# EAGLE design coreV.01 (EAGLE 7.2.0)
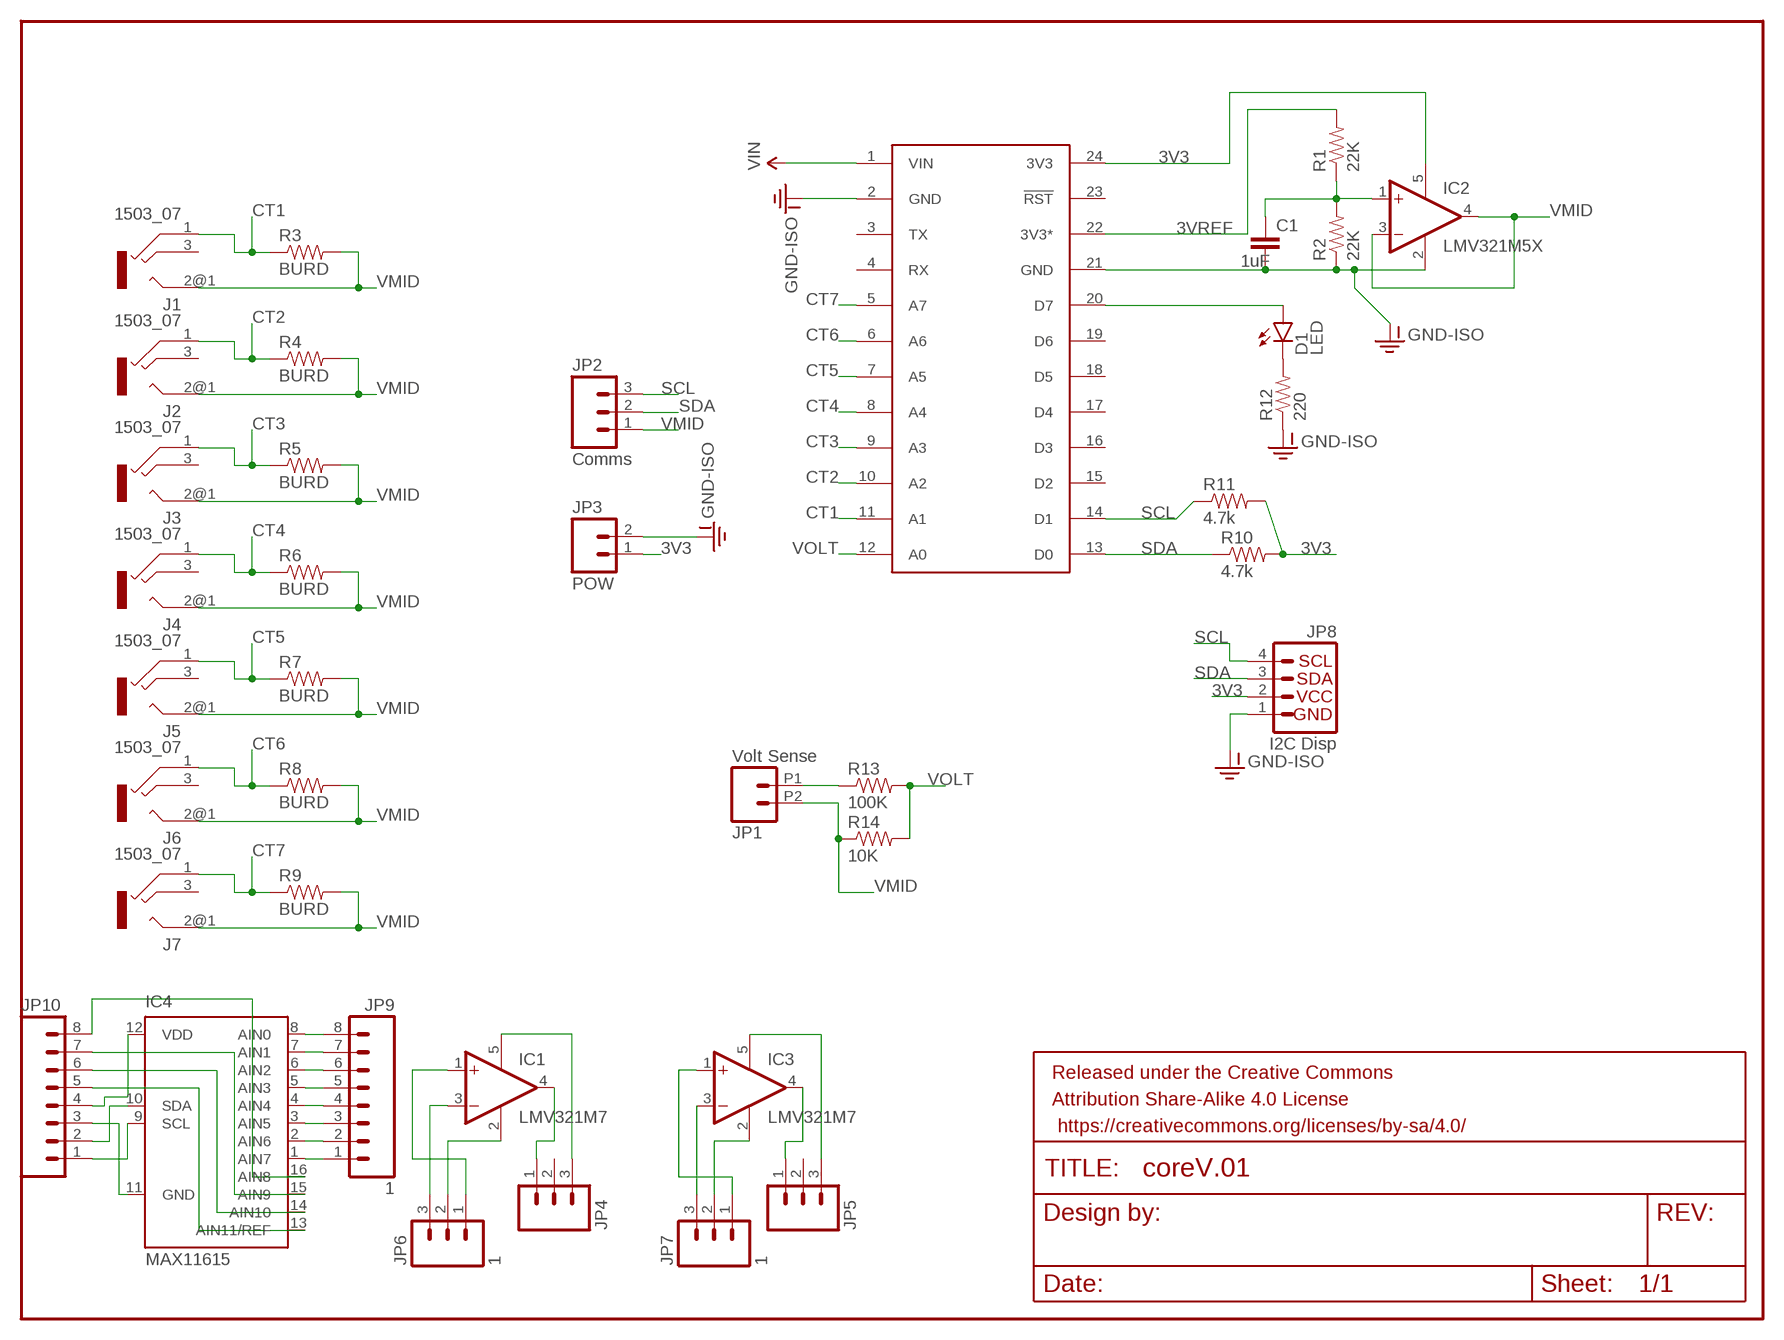
[diagram p0: schematic, sheet 1]

## Parts
C1  1uF  CAPPTH  [CAP-PTH-SMALL]
D1  LED  LED3MM  [LED3MM]
FRAME1  emonCore  FRAME-LETTER  [CREATIVE_COMMONS]
IC1  LMV321M7  [SC70-5L]
IC2  LMV321M5X  [SOT23-5]
IC3  LMV321M7  [SC70-5L]
IC4  MAX11615  MAX1039  [QSOP16]
J1  1503_07  [1503_07]
J2  1503_07  [1503_07]
J3  1503_07  [1503_07]
J4  1503_07  [1503_07]
J5  1503_07  [1503_07]
J6  1503_07  [1503_07]
J7  1503_07  [1503_07]
JP1  Volt Sense  M022.54MM_SCREWTERM  [1X02_2.54_SCREWTERM]
JP2  Comms  M03PTH  [1X03]
JP3  POW  M02PTH  [1X02]
JP4  M03PTH  [1X03]
JP5  M03PTH  [1X03]
JP6  1  M03PTH  [1X03]
JP7  1  M03PTH  [1X03]
JP8  I2C Disp  I2C_STANDARD  [1X04]
JP9  1  M08SILK_FEMALE_PTH  [1X08]
JP10  M08SILK_FEMALE_PTH  [1X08]
R1  22K  RESISTORAXIAL-0.3  [AXIAL-0.3]
R2  22K  RESISTORAXIAL-0.3  [AXIAL-0.3]
R3  BURD  RESISTORAXIAL-0.3  [AXIAL-0.3]
R4  BURD  RESISTORAXIAL-0.3  [AXIAL-0.3]
R5  BURD  RESISTORAXIAL-0.3  [AXIAL-0.3]
R6  BURD  RESISTORAXIAL-0.3  [AXIAL-0.3]
R7  BURD  RESISTORAXIAL-0.3  [AXIAL-0.3]
R8  BURD  RESISTORAXIAL-0.3  [AXIAL-0.3]
R9  BURD  RESISTORAXIAL-0.3  [AXIAL-0.3]
R10  4.7k  RESISTORAXIAL-0.3  [AXIAL-0.3]
R11  4.7k  RESISTORAXIAL-0.3  [AXIAL-0.3]
R12  220  RESISTORAXIAL-0.3  [AXIAL-0.3]
R13  100K  RESISTORAXIAL-0.3  [AXIAL-0.3]
R14  10K  RESISTORAXIAL-0.3  [AXIAL-0.3]
U$1  SPARK_CORE  SPARK_CORECORE  [SPARK_CORE]

## Nets
3V3: IC2.5(V+) JP3.1 JP8.2 R10.P$2 R11.P$2 U$1.24(3V3)
3VREF: R1.P$2 U$1.22(3V3*)
CT1: J1.1 R3.P$1 U$1.11(A1)
CT2: J2.1 R4.P$1 U$1.10(A2)
CT3: J3.1 R5.P$1 U$1.9(A3)
CT4: J4.1 R6.P$1 U$1.8(A4)
CT5: J5.1 R7.P$1 U$1.7(A5)
CT6: J6.1 R8.P$1 U$1.6(A6)
CT7: J7.1 R9.P$1 U$1.5(A7)
GND-ISO: C1.2 IC2.2(V-) JP3.2 JP8.1 R2.P$1 R12.P$1 U$1.2(GND) U$1.21(GND)
N$1: D1.K(C) R12.P$2
N$2: C1.1 IC2.1(+IN) R1.P$1 R2.P$2
N$3: JP1.P1 R13.P$1
N$4: D1.A U$1.20(D7)
N$5: IC3.2(V-) JP7.2
N$6: IC3.1(+IN) JP7.1
N$7: IC3.3(-IN) JP7.3
N$8: IC3.4(OUT) JP5.1
N$9: IC1.2(V-) JP6.2
N$10: IC3.5(V+) JP5.3
N$11: IC1.3(-IN) JP6.3
N$12: IC1.1(+IN) JP6.1
N$13: IC1.4(OUT) JP4.1
N$14: IC1.5(V+) JP4.3
N$15: IC4.1(AIN7) JP9.1
N$16: IC4.2(AIN6) JP9.2
N$17: IC4.3(AIN5) JP9.3
N$18: IC4.4(AIN4) JP9.4
N$19: IC4.5(AIN3) JP9.5
N$20: IC4.6(AIN2) JP9.6
N$21: IC4.7(AIN1) JP9.7
N$22: IC4.8(AIN0) JP9.8
N$23: IC4.9(SCL) JP10.1
N$24: IC4.10(SDA) JP10.2
N$25: IC4.11(GND) JP10.3
N$27: IC4.12(VDD) JP10.4
N$28: IC4.13(AIN11/REF) JP10.5
N$29: IC4.14(AIN10) JP10.6
N$30: IC4.15(AIN9) JP10.7
N$31: IC4.16(AIN8) JP10.8
SCL: JP2.3 JP8.4 R11.P$1 U$1.14(D1)
SDA: JP2.2 JP8.3 R10.P$1 U$1.13(D0)
VIN: U$1.1(VIN)
VMID: IC2.3(-IN) IC2.4(OUT) J1.2@1 J2.2@1 J3.2@1 J4.2@1 J5.2@1 J6.2@1 J7.2@1 JP1.P2 JP2.1 R3.P$2 R4.P$2 R5.P$2 R6.P$2 R7.P$2 R8.P$2 R9.P$2 R14.P$1
VOLT: R13.P$2 R14.P$2 U$1.12(A0)
Unconnected: J1.2@2 J1.3 J2.2@2 J2.3 J3.2@2 J3.3 J4.2@2 J4.3 J5.2@2 J5.3 J6.2@2 J6.3 J7.2@2 J7.3 JP4.2 JP5.2 U$1.3(TX) U$1.4(RX) U$1.15(D2) U$1.16(D3) U$1.17(D4) U$1.18(D5) U$1.19(D6) U$1.23(!RST)

## Library data of the parts
C1 = SparkFun-Capacitors:CAP: Capacitor Standard 0603 ceramic capacitor, and 0.1" leaded capacitor.
D1 = SparkFun-LED:LED: LEDs Standard schematic elements and footprints for 5mm, 3mm, 1206, and 0603 sized LEDs. 5mm - Spark Fun Electronics SKU : COM-00529 (and others)
FRAME1 = SparkFun-Aesthetics:FRAME-LETTER: Schematic Frame Standard 8.5x11 US Letter frame; DESIGNER: NAME; VERSION: v01
IC1-IC3 = linear:LMV321?*: General Purpose, Low Voltage, Rail-to-Rail Output Operational Amplifiers Source: http://www.national.com/mpf/LM/LMV321.html http://www.national.com/dt/lmv_qual.pdf
IC4 = maxim:MAX10*: 2.7V to 5.5V, Low-Power, 4-/12-Channel 2-Wire Serial 8-Bit ADCs Source: http://datasheets.maxim-ic.com/en/ds/MAX1036-MAX1039M.pdf; MF: MAXIM; MPN: MAX1039AEEE+; OC_FARNELL: 1379845; OC_NEWARK: 23K5590
J1-J7 = con-lumberg:1503_?: Jack connectors according to JISC 6560, 3.5 mm Klinkensteckverbinder nach JISC 6560, 3,5 mm Source: http://www.lumberg.com/Produkte/PDFs/1503_08.pdf; OC_FARNELL: unknown; OC_NEWARK: unknown
JP1 JP3 = SparkFun-Connectors:M02: Standard 2-pin 0.1" header. Use with - straight break away headers ( PRT-00116) - right angle break away headers (PRT-00553) - swiss pins (PRT-00743) - machine pins (PRT-00117) - female headers (PRT-00115) Molex polarized connector foot print use with: PRT-08233 with associated crimp pins and housings. 2.54_SCREWTERM for use with PRT-10571. 3.5mm Screw Terminal footprints for PRT-08084 5mm Screw Terminal footprints for use with PRT-08432
JP2 JP4-JP7 = SparkFun-Connectors:M03: Header 3 Standard 3-pin 0.1" header. Use with straight break away headers (SKU : PRT-00116), right angle break away headers (PRT-00553), swiss pins (PRT-00743), machine pins (PRT-00117), and female headers (PRT-00115). Molex polarized connector foot print use with SKU : PRT-08232 with associated crimp pins and housings.
JP8 = SparkFun-Connectors:I2C_STANDARD: SparkFun has standardized on a pinout for all I2C based sensor breakouts. This pinout allows I2C boards to be plugged directly into the headers on Arduino Uno compatible boards, and to be daisy chained easily.
JP9 JP10 = SparkFun-Connectors:M08: Header 8 Standard 8-pin 0.1" header. Use with straight break away headers (SKU : PRT-00116), right angle break away headers (PRT-00553), swiss pins (PRT-00743), machine pins (PRT-00117), and female headers (PRT-00115).; PROD_ID: CONN-08438
R1-R14 = SparkFun-Passives:RESISTOR: Resistor Basic schematic elements and footprints for 0603, 1206, and PTH resistors.
U$1 = Spark:SPARK_CORE

## Net classes
0 default: clearance 0.205 mm

## Board
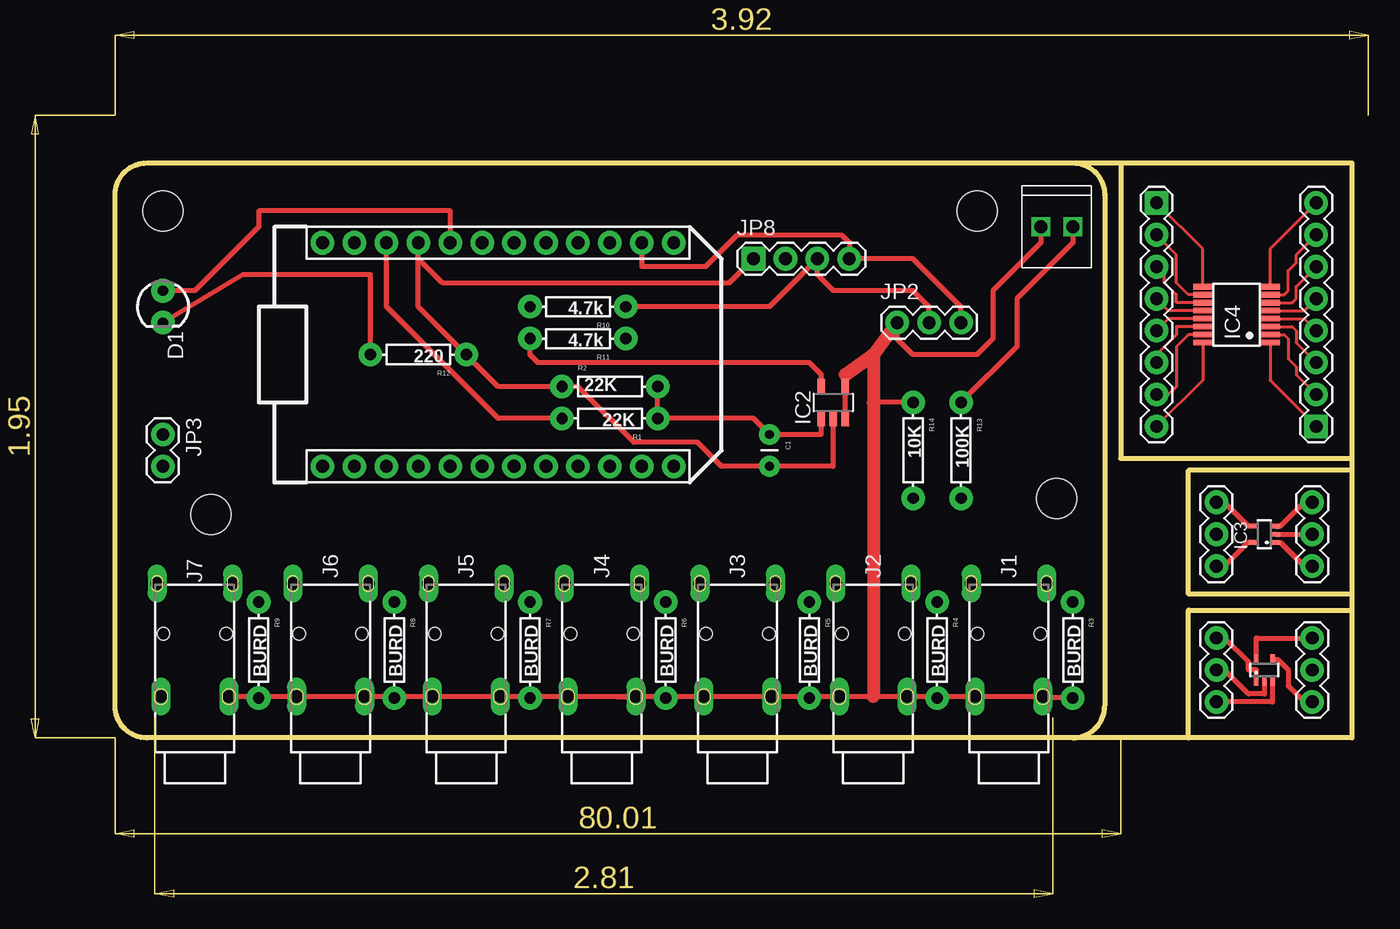
[diagram p1: board, top side]
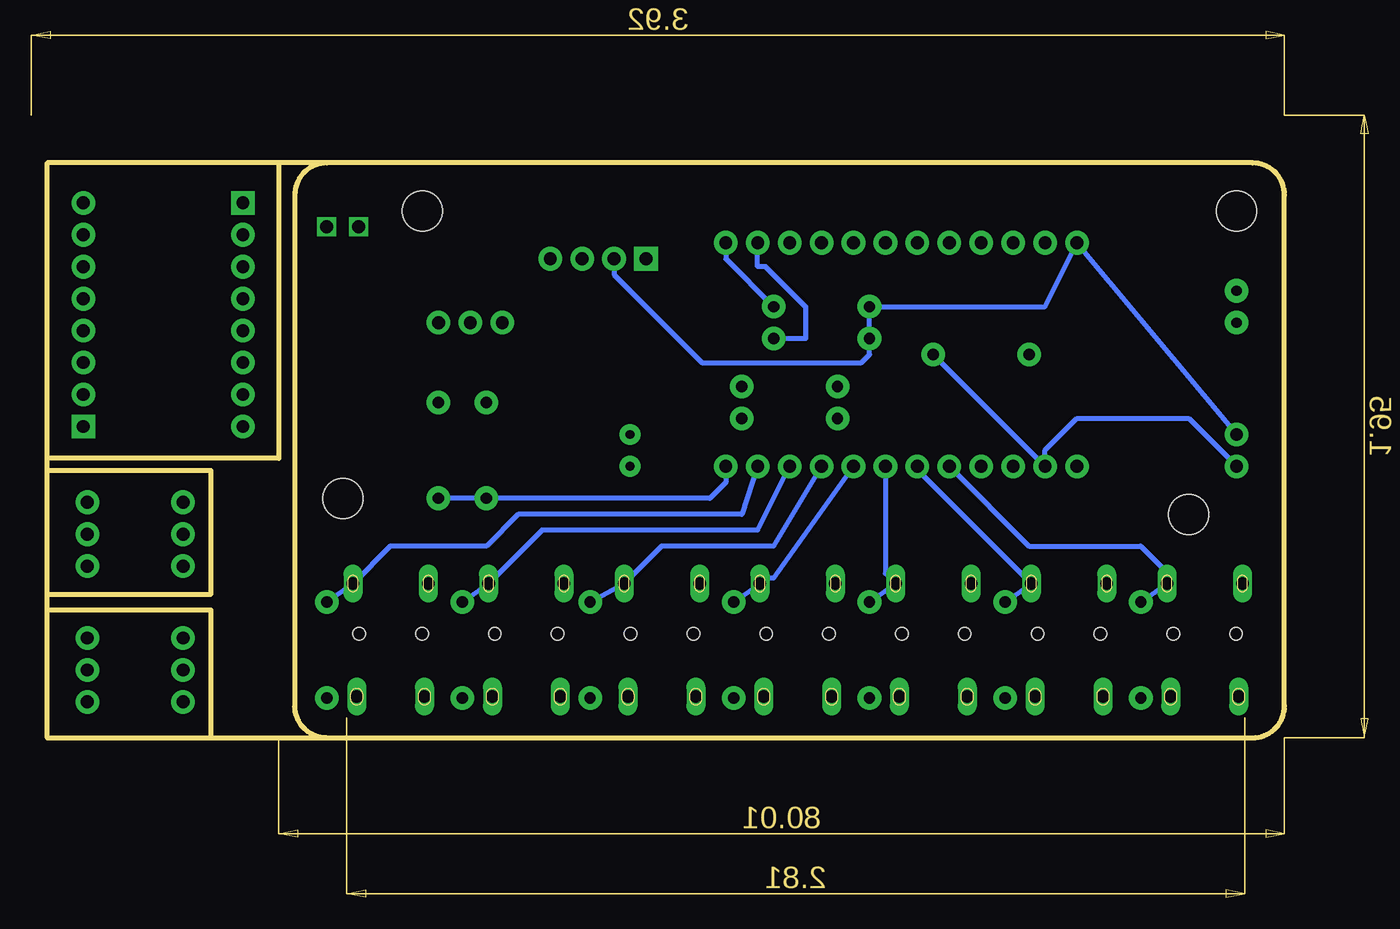
[diagram p2: board, bottom side, seen from below]

Size 98.42 x 45.72 mm. Coordinates in mm from the lower left corner, seen from the top.
Outline: 76.2,45.72 2.54,45.72 arc90 0,43.18 0,2.54 arc90 2.54,0 76.2,0
Outline: 76.2,45.72 80.01,45.72
Outline: 80.01,45.72 98.42,45.72 98.42,22.23
Outline: 85.41,0 98.42,0 98.42,10.16
Outline: 85.41,0 76.2,0
Outline: 98.42,10.16 98.42,11.43
Outline: 98.42,11.43 98.42,21.27
Outline: 98.42,21.27 98.42,22.23
Outline: 76.2,0 arc90 78.74,2.54 78.74,43.18 arc90 76.2,45.72
Outline: 80.01,45.72 80.01,22.23 98.42,22.23
Outline: 98.42,21.27 85.41,21.27 85.41,11.43 98.42,11.43
Outline: 85.41,0 85.41,10.16 98.42,10.16
Copper layers (1*16): Top 0.035mm / dielectric 1.5mm / Bottom 0.035mm
Design rules "SeeedStudio_2layer_DRU_no_angle_20140221": minimum track width 6mil, minimum drill 12mil, track to track 6mil, track to pad 6mil, pad to pad 6mil, via to via 6mil, smd to smd 0mil, copper to edge 10mil, drill to drill 10mil, minimum pad ring 10mil, minimum via ring 6mil, stop-mask expansion 2mil, vias tented up to drill 100mil, thermal gap 10mil
Holes 3.2 mm at 3.81,41.91 68.58,41.91 7.62,17.78 74.93,19.05

### Footprints (pad centres in the part's own frame; a part is rotated, then mirrored left to right if it is on the bottom)
CAP-PTH-SMALL = drill 0.7 pad 1.651: 1 0,0; 2 2.54,0
LED3MM = drill 0.813 pad 1.88: A -1.27,0; K 1.27,0
SC70-5L = smd 0.35 x 0.8: 1 -0.65,-0.85; 2 0,-0.85; 3 0.65,-0.85; 4 0.65,0.85; 5 -0.65,0.85
SOT23-5 = smd 0.6 x 1.2: 1 -0.95,-1.306; 2 0,-1.306; 3 0.95,-1.306; 4 0.95,1.306; 5 -0.95,1.306
QSOP16 = smd 0.45 x 1.5: 1 -2.223,-2.69; 2 -1.587,-2.69; 3 -0.953,-2.69; 4 -0.318,-2.69; 5 0.318,-2.69; 6 0.953,-2.69; 7 1.587,-2.69; 8 2.223,-2.69; 9 2.223,2.69; 10 1.587,2.69; 11 0.953,2.69; 12 0.318,2.69; 13 -0.318,2.69; 14 -0.953,2.69; 15 -1.587,2.69; 16 -2.223,2.69
1503_07 = drill 1 pad 1.2 long: 1 -3,-11; 2@1 -2.7,-2; 2@2 2.7,-2; 3 3,-11 | hole 1: -2.5,-7; 2.5,-7
1X02_2.54_SCREWTERM = drill 1.016 square: P1 2.54,0; P2 0,0
1X03 = drill 1.016 pad 1.88: 1 0,0; 2 2.54,0; 3 5.08,0
1X02 = drill 1.016 pad 1.88: 1 0,0; 2 2.54,0
1X04 = drill 1.016 pad 1.88 square: 1 0,0 | drill 1.016 pad 1.88: 2 2.54,0; 3 5.08,0; 4 7.62,0
1X08 = drill 1.016 pad 1.88 square: 1 0,0 | drill 1.016 pad 1.88: 2 2.54,0; 3 5.08,0; 4 7.62,0; 5 10.16,0; 6 12.7,0; 7 15.24,0; 8 17.78,0
AXIAL-0.3 = drill 0.9 pad 1.88: P$1 -3.81,0; P$2 3.81,0
SPARK_CORE = drill 1.016 pad 1.88: 1 -8.89,13.97; 2 -8.89,11.43; 3 -8.89,8.89; 4 -8.89,6.35; 5 -8.89,3.81; 6 -8.89,1.27; 7 -8.89,-1.27; 8 -8.89,-3.81; 9 -8.89,-6.35; 10 -8.89,-8.89; 11 -8.89,-11.43; 12 -8.89,-13.97; 13 8.89,-13.97; 14 8.89,-11.43; 15 8.89,-8.89; 16 8.89,-6.35; 17 8.89,-3.81; 18 8.89,-1.27; 19 8.89,1.27; 20 8.89,3.81; 21 8.89,6.35; 22 8.89,8.89; 23 8.89,11.43; 24 8.89,13.97

### Placement (x,y rotation side)
C1  52.07,24.13 270 top
D1  3.81,34.29 270 top
FRAME1  19.05,-24.13 0 top  (outside the outline)
IC1  91.44,5.4 0 top
IC2  57.15,26.67 0 top
IC3  91.44,16.19 90 top
IC4  89.22,33.66 90 top
J1  71.12,1.27 180 top
J2  60.33,1.27 180 top
J3  49.53,1.27 180 top
J4  38.73,1.27 180 top
J5  27.94,1.27 180 top
J6  17.14,1.27 180 top
J7  6.35,1.27 180 top
JP1  73.66,40.64 0 top
JP2  62.23,33.02 0 top
JP3  3.81,24.13 270 top
JP4  95.25,2.86 90 top
JP5  87.63,18.73 270 top
JP6  87.63,7.94 270 top
JP7  95.25,13.65 90 top
JP8  50.8,38.1 0 top
JP9  95.57,24.77 90 top
JP10  82.87,42.55 270 top
R1  39.37,25.4 180 top
R2  39.37,27.94 0 top
R3  76.2,6.99 270 top
R4  65.41,6.99 270 top
R5  55.24,6.99 270 top
R6  43.81,6.99 270 top
R7  33.02,6.99 270 top
R8  22.23,6.99 270 top
R9  11.43,6.99 270 top
R10  36.83,34.29 180 top
R11  36.83,31.75 180 top
R12  24.13,30.48 180 top
R13  67.31,22.86 270 top
R14  63.5,22.86 270 top
U$1  30.48,30.48 90 top

### Tracks (layer width: path | path; a pad name or v marks a point on that pad's centre or on a via)
3V3
  Top 0.406: IC2.5 56.2,28.89 55.24,29.84 33.66,29.84 33.02,30.48 R11.P$2
  Bottom 0.152: 16.66,39.47 U$1.24
  Bottom 0.406: JP8.2 53.34,36.83 46.35,29.84 33.66,29.84 33.02,30.48 R11.P$2 R10.P$2 19.05,34.29 U$1.24 JP3.1
3VREF
  Top 0.406: R1.P$2 30.48,25.4 21.59,34.29 U$1.22
CT1
  Bottom 0.406: R3.P$1 J1.1 71.15,15.24 63.5,15.24 60.96,17.78 43.18,17.78 U$1.11
CT2
  Bottom 0.406: R4.P$1 J2.1 59.09,16.51 41.91,16.51 U$1.10
CT3
  Bottom 0.406: R5.P$1 J3.1 49.56,15.24 40.64,15.24 U$1.9
CT4
  Bottom 0.406: R6.P$1 J4.1 41.3,12.7 40.64,12.7 U$1.8
CT5
  Bottom 0.406: R7.P$1 J5.1 31.75,13.08 U$1.7
CT6
  Bottom 0.406: R8.P$1 J6.1 29.21,21.34 U$1.6
CT7
  Bottom 0.406: R9.P$1 J7.1 8.92,12.7 8.89,12.7 11.43,15.24 20.32,15.24 U$1.5
GND-ISO
  Top 0.406: R12.P$1 30.48,27.94 R2.P$1 36.83,27.94 41.27,23.5 46.35,23.5 48.26,21.59 C1.2 57.15,21.59 IC2.2 | R12.P$1 24.13,34.29 U$1.21 24.13,38.1 26.04,36.2 48.9,36.2 JP8.1 | 29.21,29.21 R12.P$1
  Bottom 0.152: 24.13,39.47 U$1.21
  Bottom 0.406: R12.P$1 U$1.2 19.05,22.86 16.51,25.4 7.62,25.4 JP3.2
N$1
  Top 0.406: R12.P$2 20.32,36.83 10.16,36.83 D1.K
N$2
  Top 0.406: R2.P$2 R1.P$1 50.8,25.4 C1.1 56.2,24.13 IC2.1
N$3
  Top 0.406: JP1.P1 76.2,39.37 71.75,34.92 71.75,31.11 R13.P$1
N$4
  Top 0.406: U$1.20 26.67,41.91 11.43,41.91 11.43,40.64 6.35,35.56 D1.A
N$5
  Top 0.406: IC3.2 JP7.2
N$6
  Top 0.406: IC3.1 92.72,15.54 94.61,13.65 JP7.1
N$7
  Top 0.406: IC3.3 92.72,16.84 94.61,18.73 JP7.3
N$8
  Top 0.406: IC3.4 90.16,16.84 88.27,18.73 JP5.1
N$9
  Top 0.406: IC1.2 91.44,3.49 90.17,3.49 88.27,5.4 JP6.2
N$10
  Top 0.406: IC3.5 90.16,15.54 88.27,13.65 JP5.3
N$11
  Top 0.406: IC1.3 92.09,2.87 92.08,2.86 JP6.3
N$12
  Top 0.406: IC1.1 90.79,5.38 90.81,5.4 90.17,5.4 90.17,6.03 88.27,7.94 JP6.1
N$13
  Top 0.406: IC1.4 92.5,6.25 93.34,5.4 93.34,4.13 94.61,2.86 JP4.1
N$14
  Top 0.406: IC1.5 90.79,7.92 90.81,7.94 JP4.3
N$15
  Top 0.254: IC4.1 91.91,28.43 JP9.1
N$16
  Top 0.254: IC4.2 93.03,32.07 93.34,31.75 93.34,30.16 93.98,29.53 93.98,28.89 JP9.2
N$17
  Top 0.254: IC4.3 93.66,32.7 93.98,32.38 93.98,31.43 JP9.3
N$18
  Top 0.254: IC4.4 94.61,33.34 JP9.4
N$19
  Top 0.254: IC4.5 94.61,33.97 JP9.5
N$20
  Top 0.254: IC4.6 93.66,34.61 93.98,34.92 93.98,35.88 JP9.6
N$21
  Top 0.254: IC4.7 93.03,35.24 93.34,35.56 93.34,37.15 93.98,37.78 93.98,38.42 JP9.7
N$22
  Top 0.254: IC4.8 91.91,38.88 JP9.8
N$23
  Top 0.254: IC4.9 86.53,38.88 JP10.1
N$24
  Top 0.254: IC4.10 85.41,35.24 84.45,36.2 84.45,38.42 JP10.2
N$25
  Top 0.254: IC4.11 84.45,34.61 84.45,35.24 83.5,36.2 83.5,36.83 JP10.3
N$27
  Top 0.254: IC4.12 83.82,33.97 JP10.4
N$28
  Top 0.254: IC4.13 83.82,33.34 JP10.5
N$29
  Top 0.254: IC4.14 84.45,32.7 84.45,32.07 83.19,30.8 83.19,30.16 JP10.6
N$30
  Top 0.254: JP10.7 83.82,27.3 84.45,27.94 84.45,31.11 85.41,32.07 IC4.15
N$31
  Top 0.254: IC4.16 86.53,28.43 JP10.8
SCL
  Top 0.406: JP2.3 67.31,34.29 63.5,38.1 JP8.4 58.42,39.37 57.78,40.01 49.53,40.01 46.99,37.47 41.91,37.47 U$1.14
  Bottom 0.406: R11.P$1 38.1,31.75 38.1,34.29 41.27,37.47 41.91,37.47 U$1.14
SDA
  Top 0.406: R10.P$1 52.07,34.29 JP8.3 55.88,36.83 57.15,35.56 63.5,35.56 64.77,34.29 JP2.2
  Bottom 0.406: U$1.13 44.45,38.1 R10.P$1
VMID
  Top 0.406: 64.77,3.27 J1.2@1 73.92,3.17 R3.P$2 | 64.77,3.27 J2.2@1 60.33,3.27 54.61,3.27 | J4.2@1 33.02,3.27 | 33.02,3.27 J5.2@1 21.59,3.27 | 11.43,3.27 J6.2@1 21.59,3.27 | 11.43,3.27 J7.2@1 | 54.61,3.27 J3.2@1 43.18,3.27 | 43.18,3.27 J4.2@1 | 39.91,3.27 J4.2@1 | 58.1,28.89 IC2.4 IC2.3 | JP2.1 62.23,31.75 63.5,30.48 68.58,30.48 69.85,31.75 69.85,35.56 73.66,39.37 JP1.P2 | R4.P$2 64.86,3.17 64.77,3.27 | R5.P$2 54.7,3.17 54.61,3.27 | R6.P$2 43.27,3.17 43.18,3.27 | R7.P$2 33.02,3.27 | R8.P$2 21.68,3.17 21.59,3.27 | R9.P$2 11.43,3.27 | R14.P$1 60.33,26.67
  Top 1.016: 60.33,30.48 JP2.1 | 58.1,28.89 60.33,30.48 | 60.33,30.48 60.33,26.67 60.33,3.27
VOLT
  Bottom 0.406: R13.P$2 R14.P$2 45.72,19.05 44.45,20.32 U$1.12